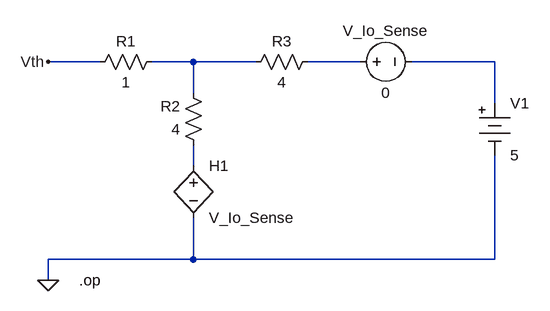
[diagram p0: schematic g3_p18_Vth.asc]
g3_p18_Vth.asc, the LTspice schematic file:
Version 4
SHEET 1 880 680
WIRE 16 96 -64 96
WIRE 160 96 96 96
WIRE 256 96 160 96
WIRE 416 96 336 96
WIRE 624 96 496 96
WIRE 160 144 160 96
WIRE 624 160 624 96
WIRE 160 256 160 224
WIRE 160 400 160 336
WIRE 160 400 -64 400
WIRE 624 400 624 240
WIRE 624 400 160 400
WIRE -64 432 -64 400
FLAG -64 432 0
FLAG -64 96 Vth
SYMBOL res 112 80 R90
WINDOW 0 0 56 VBottom 2
WINDOW 3 32 56 VTop 2
SYMATTR InstName R1
SYMATTR Value 1
SYMBOL res 176 240 R180
WINDOW 0 36 76 Left 2
WINDOW 3 36 40 Left 2
SYMATTR InstName R2
SYMATTR Value 4
SYMBOL res 240 112 R270
WINDOW 0 32 56 VTop 2
WINDOW 3 0 56 VBottom 2
SYMATTR InstName R3
SYMATTR Value 4
SYMBOL Misc\\battery 624 144 R0
SYMATTR InstName V1
SYMATTR Value 5
SYMBOL h 160 240 R0
SYMATTR InstName H1
SYMATTR Value V_Io_Sense
SYMATTR Value2 3
SYMBOL voltage 400 96 R270
WINDOW 0 32 56 VTop 2
WINDOW 3 -32 56 VBottom 2
SYMATTR InstName V_Io_Sense
SYMATTR Value 0
TEXT -16 432 Left 2 !.op

The netlist it stands for:
* g3_p18_Vth.asc
R1 N001 Vth 1
R2 N004 N001 4
R3 N001 N002 4
V1 N003 0 5
H1 N004 0 V_Io_Sense 3
V_Io_Sense N002 N003 0
.op
.backanno
.end